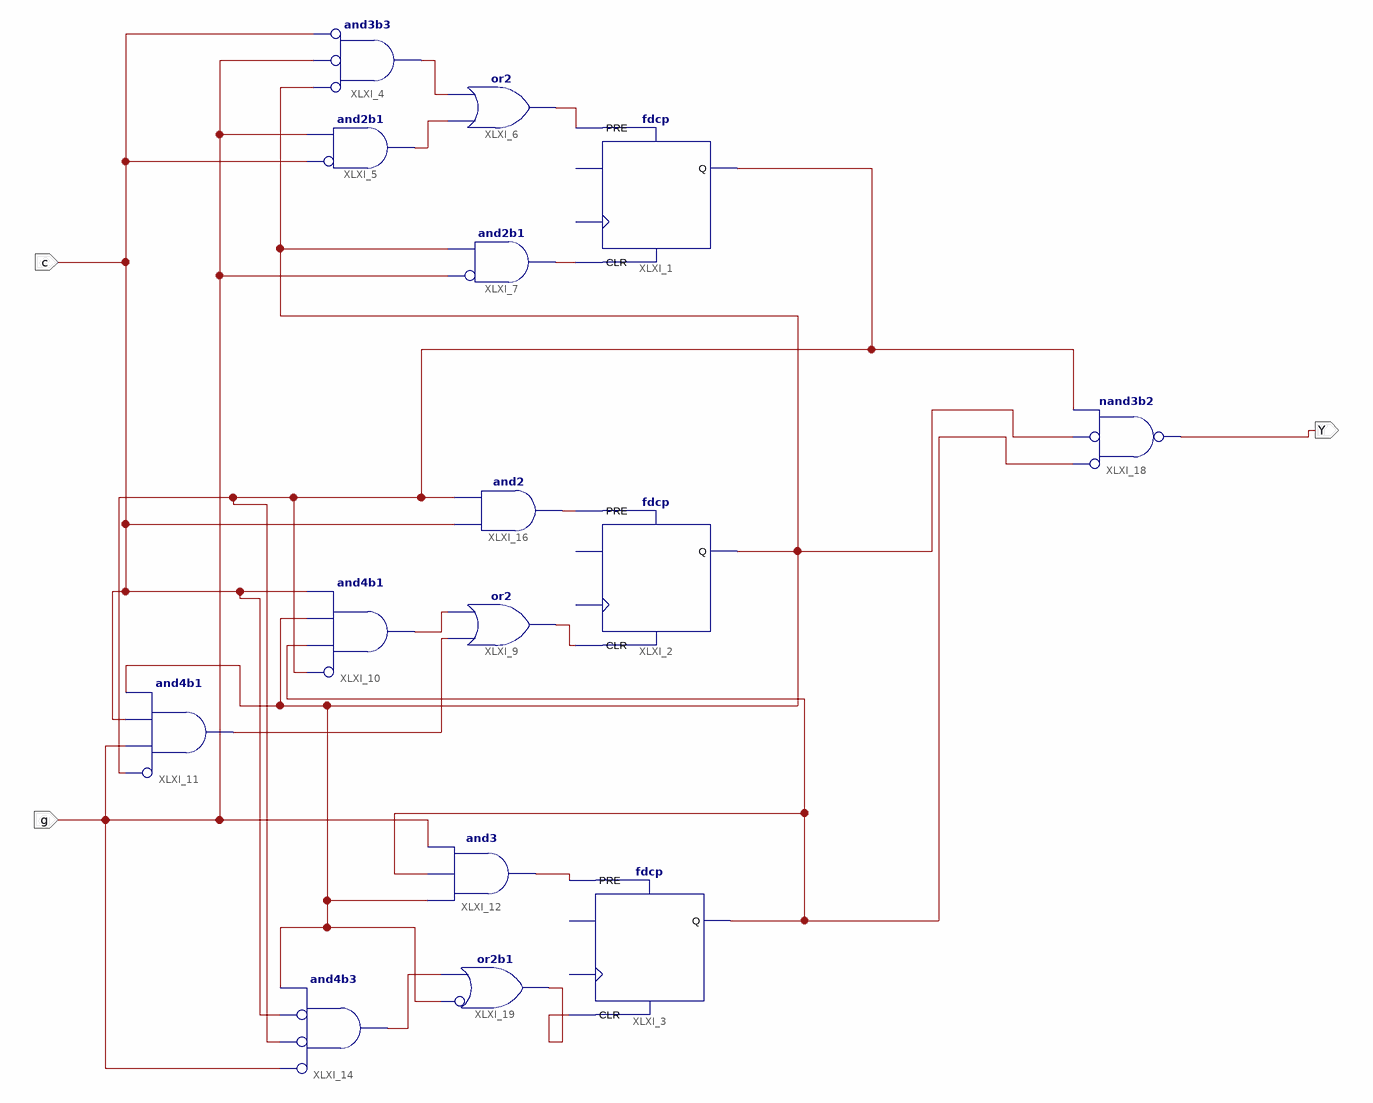
[diagram p0: schematic sheet 1]
// Xilinx ISE schematic pulse_extractor.sch (spartan3a) as structural Verilog: 15 symbols, 3 ports
module pulse_extractor (
  input  c,
  input  g,
  output Y
);

  wire XLXN_7, XLXN_8, XLXN_9, XLXN_11, XLXN_12, XLXN_13, XLXN_14, XLXN_15, XLXN_28, XLXN_68, XLXN_72,
       XLXN_74, XLXN_77, XLXN_78;

  fdcp XLXI_1 (.CLR(XLXN_11), .PRE(XLXN_12), .Q(XLXN_68));  // open: C, D
  fdcp XLXI_2 (.CLR(XLXN_9), .PRE(XLXN_28), .Q(XLXN_74));  // open: C, D
  fdcp XLXI_3 (.CLR(XLXN_78), .PRE(XLXN_15), .Q(XLXN_72));  // open: C, D
  and XLXI_4 (XLXN_13, ~XLXN_74, ~g, ~c);  // and3b3
  and XLXI_5 (XLXN_14, ~c, g);  // and2b1
  or XLXI_6 (XLXN_12, XLXN_14, XLXN_13);
  and XLXI_7 (XLXN_11, ~g, XLXN_74);  // and2b1
  or XLXI_9 (XLXN_9, XLXN_8, XLXN_7);
  and XLXI_10 (XLXN_7, ~XLXN_68, XLXN_72, XLXN_74, c);  // and4b1
  and XLXI_11 (XLXN_8, ~XLXN_68, g, c, XLXN_74);  // and4b1
  and XLXI_12 (XLXN_15, XLXN_74, XLXN_72, g);
  and XLXI_14 (XLXN_77, ~g, ~XLXN_68, ~c, XLXN_74);  // and4b3
  and XLXI_16 (XLXN_28, c, XLXN_68);
  nand XLXI_18 (Y, ~XLXN_72, ~XLXN_74, XLXN_68);  // nand3b2
  or XLXI_19 (XLXN_78, ~XLXN_74, XLXN_77);  // or2b1
endmodule
